# EAGLE design flasher (EAGLE 6.0)
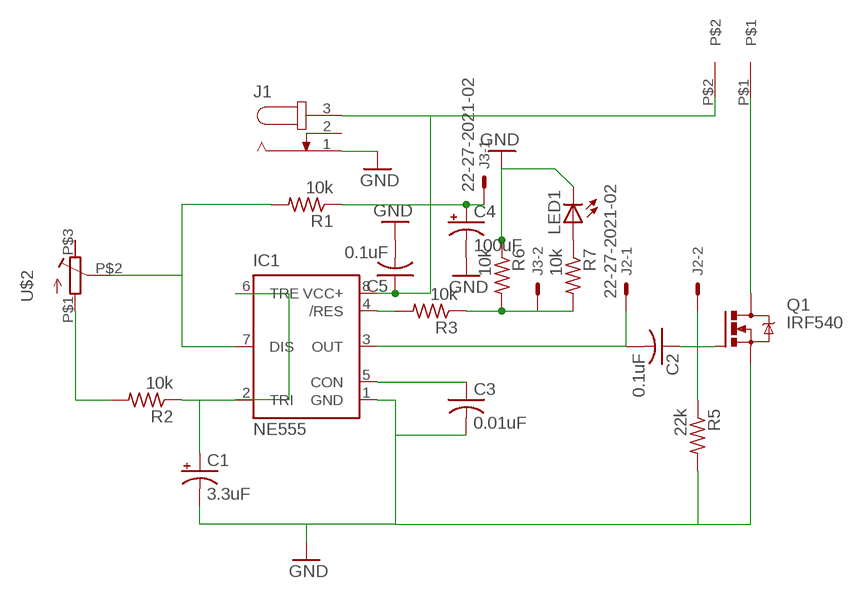
[diagram p0: schematic, sheet 1]

## Parts
C1  3.3uF  CPOL-USE2.5-5  [E2,5-5]
C2  0.1uF  C-US050-030X075  [C050-030X075]
C3  0.01uF  C-US025-025X050  [C025-025X050]
C4  100uF  CPOL-USE2.5-5  [E2,5-5]
C5  0.1uF  C-US025-025X050  [C025-025X050]
IC1  NE555  [DIL-08]
J1  JACK-PLUG0  [SPC4077]
J2  22-27-2021-02  [6410-02]
J3  22-27-2021-02  [6410-02]
LED1  LED5MM  [LED5MM]
Q1  IRF540  [TO220BV]
R1  10k  R-US_0207/10  [0207/10]
R2  10k  R-US_0207/10  [0207/10]
R3  10k  R-US_0207/10  [0207/10]
R5  22k  R-US_0207/10  [0207/10]
R6  10k  R-US_0207/10  [0207/10]
R7  10k  R-US_0207/10  [0207/10]
U$1  DG301-5.0  [DG301-5.0]
U$2  PANELMOUNT_POT  [PANELMOUNT_POT]

## Nets
GND: C1.- C3.2 C4.- C5.2 IC1.1(GND) J1.1 LED1.K(C) Q1.S R5.2 R6.1
N$2: IC1.7(DIS) R1.2 U$2.P$2
N$3: C1.+ IC1.2(TRI) IC1.6(TRE) R2.1
N$4: R2.2 U$2.P$1
N$5: C2.1 J2.2 Q1.G R5.1
N$6: C3.1 IC1.5(CON)
N$7: IC1.4(/RES) R3.2
N$8: C2.2 IC1.3(OUT) J2.1
N$9: J3.2 R3.1 R6.2 R7.2
N$10: Q1.D U$1.P$1
N$11: LED1.A R7.1
VCC: C4.+ C5.1 IC1.8(VCC+) J1.3 J3.1 R1.1 U$1.P$2
Unconnected: J1.2 U$2.P$3

## Library data of the parts
C1 C4 = resistor:CPOL-US: POLARIZED CAPACITOR, American symbol
C2 C3 C5 = resistor:C-US: CAPACITOR, American symbol
IC1 = st-microelectronics:NE555: General purpose bipolar Timer; MF: Arrow Electronics; MPN: NE555N; OC_FARNELL: 1467742; OC_NEWARK: 89K1486
J1 = con-jack:JACK-PLUG: DC POWER JACK Power Jack, DC, Right Angle, Through Hole, Rated 5A at 16VDC, PC Terminals Distributor: Farnell (www.Farnell.de) Drawing: 84N1161.pdf / 84N1162.pdf Manufacturer: SPC Technology (www.spctechnology.com) Type: SPC4077 / SPC 4078; OC_FARNELL: unknown; OC_NEWARK: unknown
J2 J3 = con-molex:22-?-02: CONNECTOR wire to board 2.54 mm (.1 inch) pitch header; OC_FARNELL: unknown; OC_NEWARK: unknown
LED1 = led:LED: LED OSRAM: - CHIPLED LG R971, LG N971, LY N971, LG Q971, LY Q971, LO R971, LY R971 LH N974, LH R974 LS Q976, LO Q976, LY Q976 LO Q996 - Hyper CHIPLED LW Q18S LB Q993, LB Q99A, LB R99A - SideLED LS A670, LO A670, LY A670, LG A670, LP A670 LB A673, LV A673, LT A673, LW A673 LH A674 LY A675 LS A676, LA A676, LO A676, LY A676, LW A676 LS A679, LY A679, LG A679 - Hyper Micro SIDELED® LS Y876, LA Y876, LO Y876, LY Y876 LT Y87S - SmartLED LW L88C, LW L88S LB L89C, LB L89S, LG L890 LS L89K, LO L89K, LY L89K LS L896, LA L896, LO L896, LY L896 - TOPLED LS T670, LO T670, LY T670, LG T670, LP T670 LSG T670, LSP T670, LSY T670, LOP T670, LYG T670 LG T671, LOG T671, LSG T671 LB T673, LV T673, LT T673, LW T673 LH T674 LS T676, LA T676, LO T676, LY T676, LB T676, LH T676, LSB T676, LW T676 LB T67C, LV T67C, LT T67C, LS T67K, LO T67K, LY T67K, LW E67C LS E67B, LA E67B, LO E67B, LY E67B, LB E67C, LV E67C, LT E67C LW T67C LS T679, LY T679, LG T679 LS T770, LO T770, LY T770, LG T770, LP T770 LB T773, LV T773, LT T773, LW T773 LH T774 LS E675, LA E675, LY E675, LS T675 LS T776, LA T776, LO T776, LY T776, LB T776 LHGB T686 LT T68C, LB T68C - Hyper Mini TOPLED® LB M676 - Mini TOPLED Santana® LG M470 LS M47K, LO M47K, LY M47K Source: http://www.osram.convergy.de LUXEON: - LUMILED® LXK2-PW12-R00, LXK2-PW12-S00, LXK2-PW14-U00, LXK2-PW14-V00 LXK2-PM12-R00, LXK2-PM12-S00, LXK2-PM14-U00 LXK2-PE12-Q00, LXK2-PE12-R00, LXK2-PE12-S00, LXK2-PE14-T00, LXK2-PE14-U00 LXK2-PB12-K00, LXK2-PB12-L00, LXK2-PB12-M00, LXK2-PB14-N00, LXK2-PB14-P00, LXK2-PB14-Q00 LXK2-PR12-L00, LXK2-PR12-M00, LXK2-PR14-Q00, LXK2-PR14-R00 LXK2-PD12-Q00, LXK2-PD12-R00, LXK2-PD12-S00 LXK2-PH12-R00, LXK2-PH12-S00 LXK2-PL12-P00, LXK2-PL12-Q00, LXK2-PL12-R00 Source: www.luxeon.com KINGBRIGHT: KA-3528ASYC Source: www.kingbright.com
Q1 = transistor-power:IRF540: HEXFET Power MOSFET
R1-R3 R5-R7 = resistor:R-US_: RESISTOR, American symbol
U$1 = RobThePyro:DG301-5.0: Degson PCB strip connector
U$2 = RobThePyro:PANELMOUNT_POT

## Board
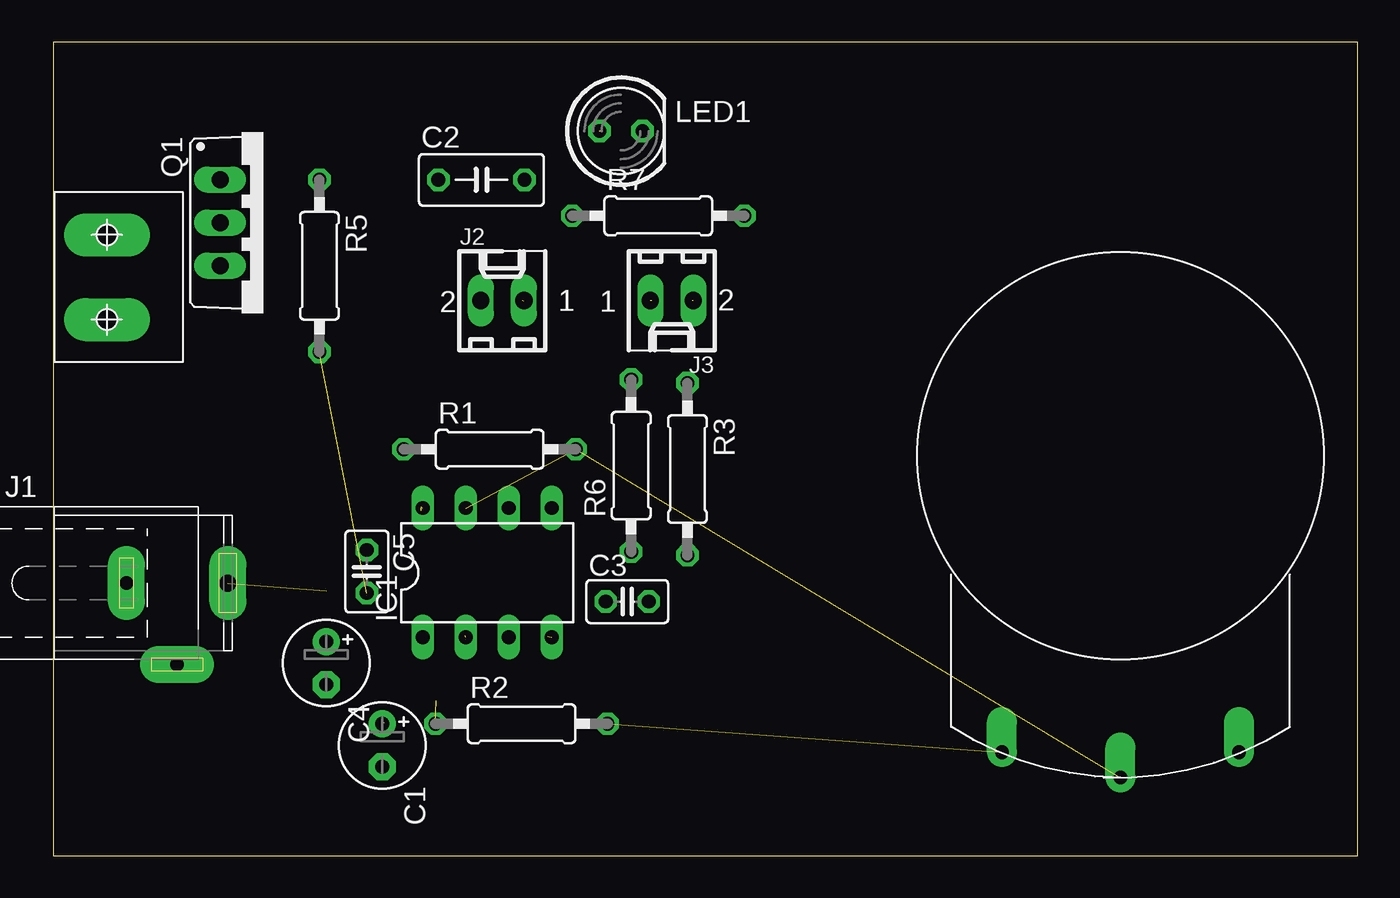
[diagram p1: board, top side]
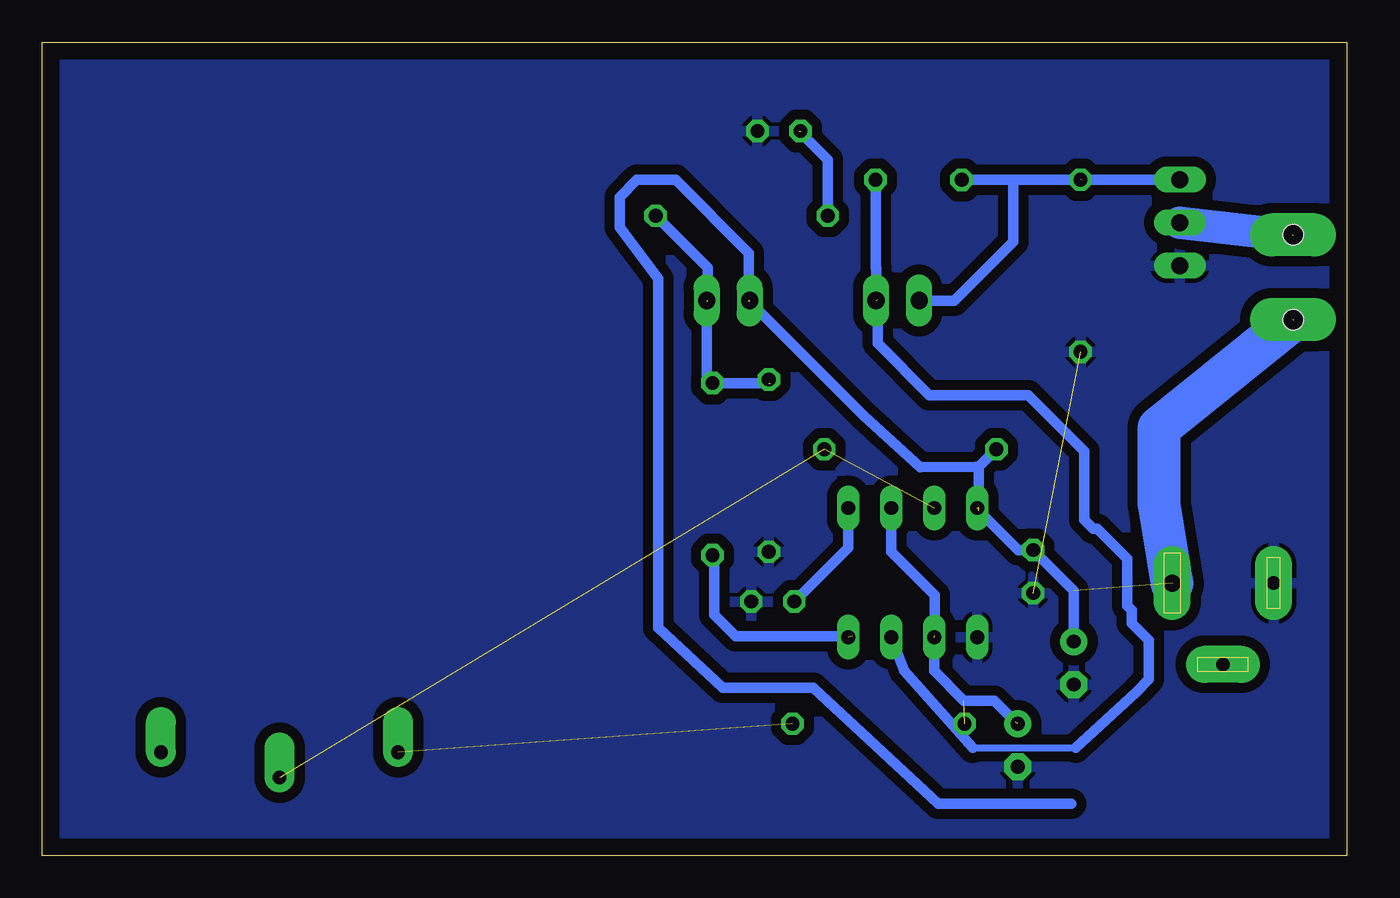
[diagram p2: board, bottom side, seen from below]

Size 77 x 48 mm. Coordinates in mm from the lower left corner, seen from the top.
Outline: 0,0 77,0 77,48 0,48 0,0
Copper layers (1*16): Top 0.035mm / dielectric 1.5mm / Bottom 0.035mm
Design rules: minimum track width 10mil, minimum drill 24mil, track to track 8mil, track to pad 8mil, pad to pad 8mil, via to via 8mil, smd to smd 8mil, copper to edge 40mil, drill to drill 8mil, minimum pad ring 10mil, minimum via ring 8mil, stop-mask expansion 4mil, vias tented up to drill 0mil, thermal gap 10mil

### Footprints (pad centres in the part's own frame; a part is rotated, then mirrored left to right if it is on the bottom)
E2,5-5 = drill 0.813 pad 1.6: + -1.27,0 | drill 0.813 pad 1.6 octagon: - 1.27,0
C050-030X075 = drill 0.813 octagon: 1 -2.54,0; 2 2.54,0
C025-025X050 = drill 0.813 octagon: 1 -1.27,0; 2 1.27,0
DIL-08 = drill 0.813 long: 1 -3.81,-3.81; 2 -1.27,-3.81; 3 1.27,-3.81; 4 3.81,-3.81; 5 3.81,3.81; 6 1.27,3.81; 7 -1.27,3.81; 8 -3.81,3.81
SPC4077 = drill 0.8 pad 2.184 long: 1 -3,0; 2 0,-4.8 | drill 1 pad 2.184 long: 3 3,0
6410-02 = drill 1.016 long: 1 1.27,0; 2 -1.27,0
LED5MM = drill 0.813 octagon: A -1.27,0; K 1.27,0
TO220BV = drill 1.016 long: D 0,-2.54; G -2.54,-2.54; S 2.54,-2.54
0207/10 = drill 0.813 octagon: 1 -5.08,0; 2 5.08,0
DG301-5.0 = drill 1.3 pad 2.54 long: P$1 2.5,3.1; P$2 7.5,3.1 | hole 1.2: 2.5,3.1; 7.5,3.1
PANELMOUNT_POT = drill 0.8 pad 1.778 offset: P$1 -7,-17.5; P$2 0,-19; P$3 7,-17.5

### Placement (x,y rotation side)
C1  19.43,6.51 270 top
C2  25.28,39.88 0 top
C3  33.89,14.99 0 top
C4  16.12,11.36 270 top
C5  18.52,16.76 270 top
IC1  25.63,16.7 0 top
J1  7.32,16.09 0 top
J2  26.52,32.76 0 top
J3  36.52,32.76 180 top
LED1  33.52,42.76 0 top
Q1  12.4,37.36 270 top
R1  25.77,23.98 0 top
R2  27.65,7.78 0 top
R3  37.44,22.81 270 top
R5  15.72,34.81 270 top
R6  34.12,23.02 90 top
R7  35.72,37.76 0 top
U$1  0.08,39.14 270 top
U$2  63,23.6 0 top

### Tracks (layer width: path | path; a pad name or v marks a point on that pad's centre or on a via)
GND  (1 unrouted)
  Bottom 0.61: C5.2 18.54,15.49
  pour Bottom (isolate 0.6): 0,48 77,48 77,0 0,0
N$2  (2 unrouted)
N$3  (3 unrouted)
  Bottom 0.61: IC1.6 26.9,17.94 24.32,15.36 24.32,12.96 | IC1.2 24.36,10.9 22.61,9.14 20.83,9.14 19.56,7.87
N$4  (1 unrouted)
N$5  (1 unrouted)
  Bottom 0.61: Q1.G 15.69,39.9 15.72,39.86 | R5.1 19.7,39.89 | 19.7,39.89 C2.1 | 19.7,39.89 19.7,36.24 23.18,32.76 J2.2
N$6
  Bottom 0.61: IC1.5 29.44,18.17 C3.1
N$7  (1 unrouted)
  Bottom 0.61: R3.2 37.34,17.63 37.34,14.22 36.07,12.95 29.21,12.95
N$8  (1 unrouted)
  Bottom 0.406: 22.1,6.35 16,6.35
  Bottom 0.61: C2.2 27.82,34.69 27.79,34.66 J2.1 | IC1.3 26.14,10.9 22.1,6.35 | 16,6.35 12.45,9.65 11.68,10.41 11.68,12.7 12.7,13.72 12.7,14.48 12.95,14.73 12.95,17.53 14.73,19.3 14.99,19.3 15.49,19.81 15.49,23.88 18.8,27.18 24.64,27.18 27.69,30.23 27.69,32.77
N$9  (2 unrouted)
  Bottom 0.406: 34.12,27.89 R6.2
  Bottom 0.61: 37.72,32.76 37.72,34.68 R7.2 | J3.2 37.79,27.89 R3.1 34.04,27.89 34.04,28.19 34.29,28.19
N$10  (1 unrouted)
  Bottom 1.93: Q1.D 3.21,36.59 3.2,36.6
N$11  (1 unrouted)
  Bottom 0.61: R7.1 30.64,41.08 32.32,42.76
VCC  (6 unrouted)
  Bottom 0.61: 21.72,20.36 19.39,18.03 C5.1 16.12,15.63 C4.+ | R1.1 21.72,22.96 | 21.72,22.96 21.92,22.96 25.17,22.91 28.52,25.96 35.32,32.76 | 21.72,20.56 21.72,22.96 | 11.08,20.76 11.33,20.51 11.38,20.56 | 16.26,3.05 24.13,3.05 31.5,9.91 36.83,9.91 40.64,13.46 40.64,34.04 42.93,37.08 42.93,38.86 41.91,39.88 39.62,39.88 35.31,35.56 35.31,32.77
  Bottom 2.54: J1.3 11.08,20.76 11.08,25.24 3.2,31.6